# Altium project Analog_computer.PrjPcb
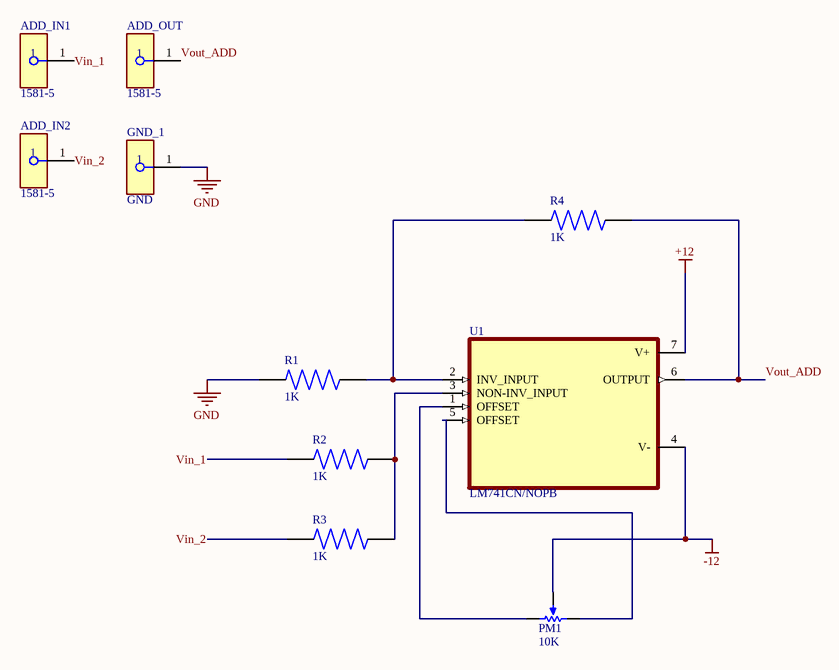
[diagram p0: Adder.SchDoc]
8 sheets, 121 parts. Net scope: global (net labels, ports and power ports of the same name join across sheets).
Board file: PCB1.PcbDoc
Sheets:
  Adder.SchDoc
  Substractor.SchDoc
  Power_IN.SchDoc
  Gain.SchDoc
  multiplier.SchDoc
  Differentiator.SchDoc
  Integrater.SchDoc
  Multiply_2.SchDoc

## Sheet Adder.SchDoc
size A; SheetNumber: 1; SheetTotal: 7

### Parts
ADD_IN1  1581-5  [FP-1581-5-MFG]
ADD_IN2  1581-5  [FP-1581-5-MFG]
ADD_OUT  1581-5  [FP-1581-5-MFG]
GND_1  GND  [FP-1581-5-MFG]
PM1  10K  [PCBComponent_1]
R1  1K  [RESAD1100W55L680D260]
R2  1K  [RESAD1100W55L680D260]
R3  1K  [RESAD1100W55L680D260]
R4  1K  [RESAD1100W55L680D260]
U1  LM741CN/NOPB  [DIP794W45P254L959H508Q8]

### Nets
+12: U1.7(V+)
-12: PM1.2(S) U1.4(V-)
GND: GND_1.1 R1.1
Vin_1: ADD_IN1.1 R2.1
Vin_2: ADD_IN2.1 R3.1
Vout_ADD: ADD_OUT.1 R4.2 U1.6(OUTPUT)
NetPM1_1: PM1.1(CCW) U1.5(OFFSET)
NetPM1_3: PM1.3(CW) U1.1(OFFSET)
NetR1_2: R1.2 R4.1 U1.2(INV_INPUT)
NetR2_2: R2.2 R3.2 U1.3(NON-INV_INPUT)

### Library data of the parts
ADD_IN1 ADD_IN2 ADD_OUT GND_1 = CMP-73906-000011-1: CONN BANANA JACK TURRET GREEN; Body Material: PC; Number of Contacts: 1; Max Current Rating: 15A; Voltage Rating (AC): 30V; Insulation: Mating End Insulated; Voltage Rating: 2.5kV; Voltage Rating (DC): 60V; Gender: Female; Height: 0.25inch; Mount: Panel; RoHS Compliant: Yes; Length: 1.22inch; Orientation: Straight; Diameter: 4.22mm; Lead Free: Lead Free; Package Quantity: 1; Termination: Turret; Current Rating: 15A; Packaging: Bag; Series: 1581; REACH SVHC: No SVHC; Number of Positions: 1; Contact Plating: Tin; Housing Color: Green; Contact Material: Brass; Insulation Material: Polycarbonate; Weight: 0.126lb; Number of Ports: 1; Color: Green; Housing Material: Polycarbonate; Width: 4inch
PM1 = Component_1
R1-R4 = MFR-25FBF52-1K: 1.07 kOhms Â±1% 0.25W, 1/4W Through Hole Resistor Axial - Metal Film; MF: Yageo; SnapEDA_Link: https://www.snapeda.com/parts/MFR-25FBF52-1K/Yageo/view-part/?ref=snap; Package: RADIAL-2 YAGEO; Value: *; MP: MFR-25FBF52-1K; Check_prices: https://www.snapeda.com/parts/MFR-25FBF52-1K/Yageo/view-part/?ref=eda
U1 = LM741CN/NOPB: Single, 44-V, 1-MHz operational amplifier; MF: Texas Instruments; SnapEDA_Link: https://www.snapeda.com/parts/LM741CN/NOPB/Texas+Instruments/view-part/?ref=snap; Package: PDIP-8 Texas; Value: *; MP: LM741CN/NOPB; Check_prices: https://www.snapeda.com/parts/LM741CN/NOPB/Texas+Instruments/view-part/?ref=eda

## Sheet Substractor.SchDoc
size A; SheetNumber: 2; SheetTotal: 7
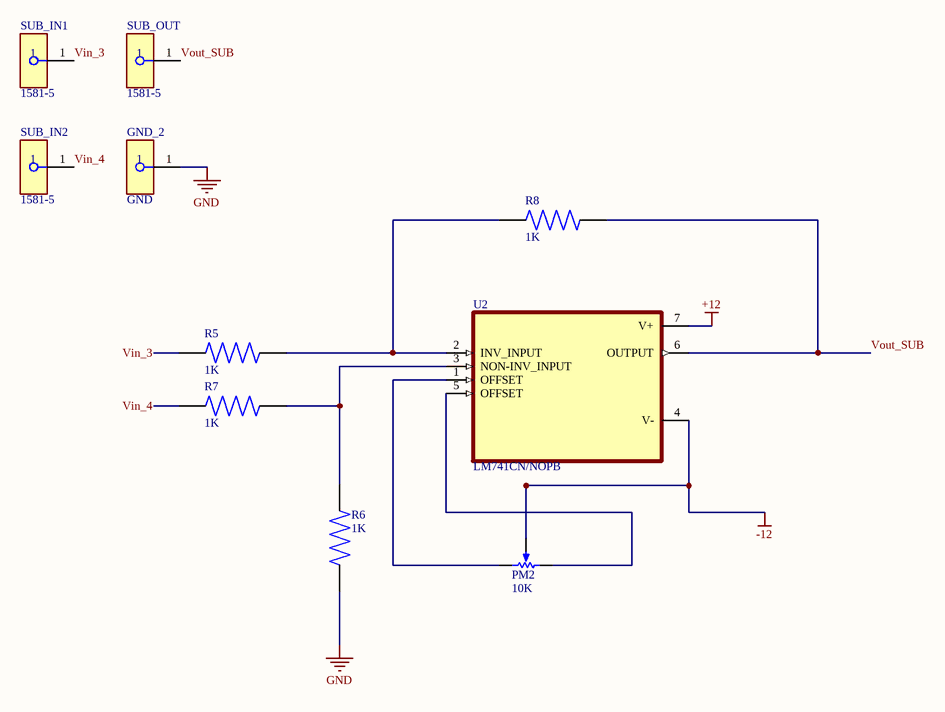
[diagram p1: Substractor.SchDoc]

### Parts
GND_2  GND  [FP-1581-5-MFG]
PM2  10K  [PCBComponent_1]
R5  1K  [RESAD1100W55L680D260]
R6  1K  [RESAD1100W55L680D260]
R7  1K  [RESAD1100W55L680D260]
R8  1K  [RESAD1100W55L680D260]
SUB_IN1  1581-5  [FP-1581-5-MFG]
SUB_IN2  1581-5  [FP-1581-5-MFG]
SUB_OUT  1581-5  [FP-1581-5-MFG]
U2  LM741CN/NOPB  [DIP794W45P254L959H508Q8]

### Nets
+12: U2.7(V+)
-12: PM2.2(S) U2.4(V-)
GND: GND_2.1 R6.1
Vin_3: R5.1 SUB_IN1.1
Vin_4: R7.1 SUB_IN2.1
Vout_SUB: R8.2 SUB_OUT.1 U2.6(OUTPUT)
NetPM2_1: PM2.1(CCW) U2.5(OFFSET)
NetPM2_3: PM2.3(CW) U2.1(OFFSET)
NetR5_2: R5.2 R8.1 U2.2(INV_INPUT)
NetR6_2: R6.2 R7.2 U2.3(NON-INV_INPUT)

### Library data of the parts
GND_2 SUB_IN1 SUB_IN2 SUB_OUT = CMP-73906-000011-1: as ADD_IN1 on sheet Adder; Height: 0.25inch; Mount: Panel; RoHS Compliant: Yes; Length: 1.22inch; Orientation: Straight; Diameter: 4.22mm; Lead Free: Lead Free; Package Quantity: 1; Termination: Turret; Current Rating: 15A; Packaging: Bag; Series: 1581; REACH SVHC: No SVHC; Number of Positions: 1; Contact Plating: Tin; Housing Color: Green; Contact Material: Brass; Insulation Material: Polycarbonate; Weight: 0.126lb; Number of Ports: 1; Color: Green; Housing Material: Polycarbonate; Width: 4inch
PM2 = Component_1
R5-R8 = MFR-25FBF52-1K: as R1 on sheet Adder; SnapEDA_Link: https://www.snapeda.com/parts/MFR-25FBF52-1K/Yageo/view-part/?ref=snap; Package: RADIAL-2 YAGEO; Value: *; MP: MFR-25FBF52-1K; Check_prices: https://www.snapeda.com/parts/MFR-25FBF52-1K/Yageo/view-part/?ref=eda
U2 = LM741CN/NOPB: as U1 on sheet Adder; SnapEDA_Link: https://www.snapeda.com/parts/LM741CN/NOPB/Texas+Instruments/view-part/?ref=snap; Package: PDIP-8 Texas; Value: *; MP: LM741CN/NOPB; Check_prices: https://www.snapeda.com/parts/LM741CN/NOPB/Texas+Instruments/view-part/?ref=eda

## Sheet Power_IN.SchDoc: Power in
size A; DocumentNumber: 01; SheetNumber: 3; SheetTotal: 7
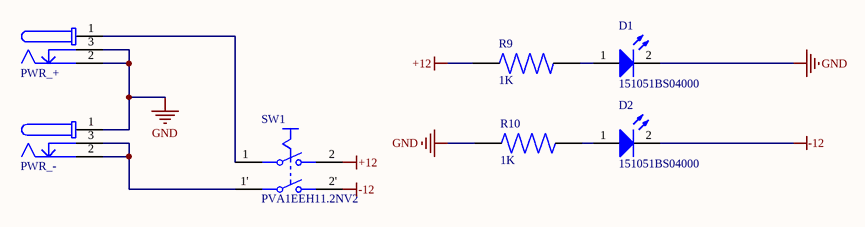
[diagram p2: Power_IN.SchDoc]

### Parts
D1  151051BS04000  [WL-TMRC_D5.9H8.7]
D2  151051BS04000  [WL-TMRC_D5.9H8.7]
PWR_+  694106301002  [PCBComponent_1]  (value not drawn)
PWR_-  694106301002  [PCBComponent_1]  (value not drawn)
R9  1K  [RESAD1100W55L680D260]
R10  1K  [RESAD1100W55L680D260]
SW1  PVA1EEH11.2NV2  [FP-PVA1EEH11_2NV2-MFG]

### Nets
+12: R9.1 SW1.2
-12: D2.2(K) SW1.2'
GND: D1.2(K) PWR_+.2 PWR_+.3 PWR_-.1 R10.1
NetD1_1: D1.1(A) R9.2
NetD2_1: D2.1(A) R10.2
NetPWR_+_1: PWR_+.1 SW1.1
NetPWR_-_2: PWR_-.2 PWR_-.3 SW1.1'

### Library data of the parts
D1 D2 = CMP-1488-00009-2: NexarPartId: 29717812; Test Current: 20mA; Forward Voltage: 3.2V; Wavelength: 470nm; Lens Size: 5mm; Lens Style: Circular, Diffused, Round; Forward Current: 100mA; Peak Wavelength: 465nm; Viewing Angle: 40°; Luminous Intensity: 500mcd; Max Reverse Voltage (DC): 5V; Color: Blue; Case/Package: Radial; Width: 5mm; Mount: Through Hole; Min Operating Temperature: -40°C; Length: 5mm; Height: 8.6mm; Max Operating Temperature: 85°C; Packaging: Bulk; RoHS: Compliant; REACH SVHC: Unknown; Dominant Wavelength: 470nm
PWR_+ PWR_- = 694106301002: DC Power Jack Connector WR-DC, Male, Right Angled, THT, 5 A, 24 V; Manufacturer: Wurth Elektronik; Current Rating: 5A; Insulation Resistance: 100MΩ; Number of Contacts: 3; Operating Supply Voltage: 24V; Shielding: Unshielded; Supplier: DigiKey; Supplier Part Number: 732-5930-ND; Manufacturer Part Number: 694106301002; RoHS: Compliant; Category: Power Connectors; Stock: 67461; Pricing: 1=0.92, 10=0.873, 50=0.774, 100=0.72, 500=0.621, 1000=0.531 (USD); Color: Black; Connector Type: Power; Contact Gender: Female; Contact Material: Gold, Tin; Contact Plating: Tin; Flammability Rating: UL94 V-0; Gender: Male; Height: 11mm; Housing Material: Polyamide; Max Operating Temperature: 85°C; Min Operating Temperature: -40°C; Mounting Technology: Through Hole; Packaging: Bulk; REACH SVHC: Unknown; Termination: Through Hole; Voltage Rating: 24V; ComponentLink1URL: https://datasheet.octopart.com:443/694106301002-W%C3%BCrth-Elektronik-datasheet-111088219.pdf?src-supplier=Newark; ComponentLink1Description: https://datasheet.octopart.com:443/694106301002-W%C3%BCrth-Elektronik-datasheet-111088219.pdf?src-supplier=Newark; ComponentLink2URL: https://datasheet.octopart.com:443/694106301002-W%C3%BCrth-Elektronik-datasheet-38737356.pdf?src-supplier=Farnell; ComponentLink2Description: https://datasheet.octopart.com:443/694106301002-W%C3%BCrth-Elektronik-datasheet-38737356.pdf?src-supplier=Farnell; ComponentLink3URL: https://datasheet.octopart.com:443/694106301002-W%C3%BCrth-Elektronik-datasheet-66582004.pdf?src-supplier=Farnell; ComponentLink3Description: https://datasheet.octopart.com:443/694106301002-W%C3%BCrth-Elektronik-datasheet-66582004.pdf?src-supplier=Farnell
R9 R10 = MFR-25FBF52-1K: as R1 on sheet Adder; SnapEDA_Link: https://www.snapeda.com/parts/MFR-25FBF52-1K/Yageo/view-part/?ref=snap; Package: RADIAL-2 YAGEO; Value: *; MP: MFR-25FBF52-1K; Check_prices: https://www.snapeda.com/parts/MFR-25FBF52-1K/Yageo/view-part/?ref=eda
SW1 = CMP-10035-000009-1: SWITCH PUSH DPST 0.1A 32V; Switch Function: Off-On; Current Rating: 100mA; Electrical Life: 100000Cycles; RoHS Compliant: Yes; Throw Configuration: DPST; Max Operating Temperature: 85°C; Voltage Rating (DC): 32V; Mount: Through Hole; Series: PVA; Min Operating Temperature: -40°C; Termination: PC Pin; Packaging: Bulk

## Sheet Gain.SchDoc
size A; SheetNumber: 4; SheetTotal: 7
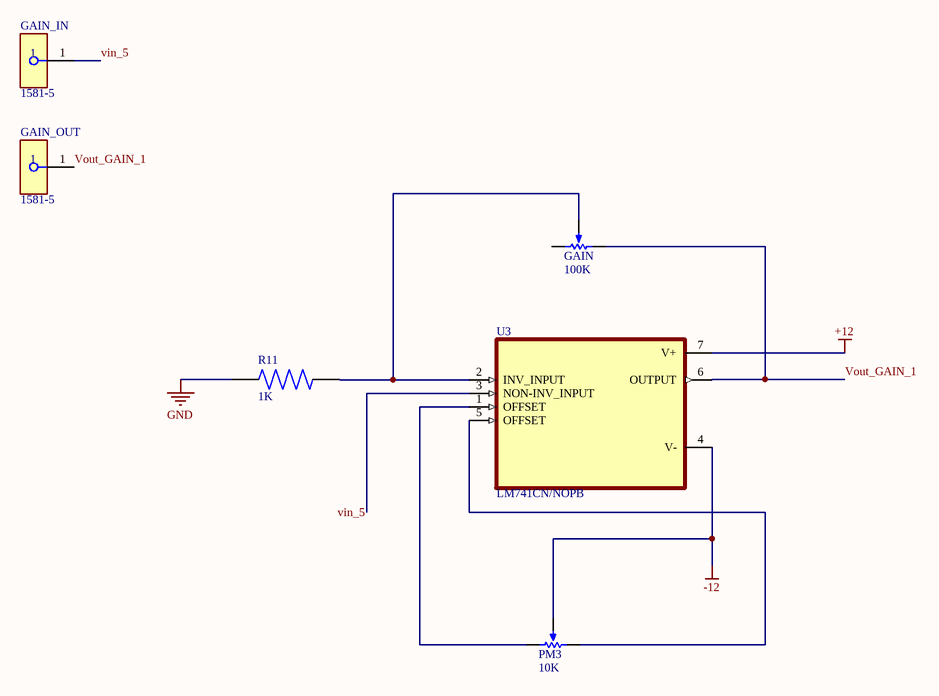
[diagram p3: Gain.SchDoc]

### Parts
GAIN  100K  [PCBComponent_1]
GAIN_IN  1581-5  [FP-1581-5-MFG]
GAIN_OUT  1581-5  [FP-1581-5-MFG]
PM3  10K  [PCBComponent_1]
R11  1K  [RESAD1100W55L680D260]
U3  LM741CN/NOPB  [DIP794W45P254L959H508Q8]

### Nets
+12: U3.7(V+)
-12: PM3.2(S) U3.4(V-)
GND: R11.1
vin_5: GAIN_IN.1 U3.3(NON-INV_INPUT)
Vout_GAIN_1: GAIN.1(CCW) GAIN_OUT.1 U3.6(OUTPUT)
NetGAIN_2: GAIN.2(S) R11.2 U3.2(INV_INPUT)
NetPM3_1: PM3.1(CCW) U3.5(OFFSET)
NetPM3_3: PM3.3(CW) U3.1(OFFSET)

Not connected (* = marked no-connect by the designer): GAIN 3(CW)

### Library data of the parts
GAIN PM3 = Component_1
GAIN_IN GAIN_OUT = CMP-73906-000011-1: as ADD_IN1 on sheet Adder; Height: 0.25inch; Mount: Panel; RoHS Compliant: Yes; Length: 1.22inch; Orientation: Straight; Diameter: 4.22mm; Lead Free: Lead Free; Package Quantity: 1; Termination: Turret; Current Rating: 15A; Packaging: Bag; Series: 1581; REACH SVHC: No SVHC; Number of Positions: 1; Contact Plating: Tin; Housing Color: Green; Contact Material: Brass; Insulation Material: Polycarbonate; Weight: 0.126lb; Number of Ports: 1; Color: Green; Housing Material: Polycarbonate; Width: 4inch
R11 = MFR-25FBF52-1K: as R1 on sheet Adder; SnapEDA_Link: https://www.snapeda.com/parts/MFR-25FBF52-1K/Yageo/view-part/?ref=snap; Package: RADIAL-2 YAGEO; Value: *; MP: MFR-25FBF52-1K; Check_prices: https://www.snapeda.com/parts/MFR-25FBF52-1K/Yageo/view-part/?ref=eda
U3 = LM741CN/NOPB: as U1 on sheet Adder; SnapEDA_Link: https://www.snapeda.com/parts/LM741CN/NOPB/Texas+Instruments/view-part/?ref=snap; Package: PDIP-8 Texas; Value: *; MP: LM741CN/NOPB; Check_prices: https://www.snapeda.com/parts/LM741CN/NOPB/Texas+Instruments/view-part/?ref=eda

## Sheet multiplier.SchDoc
size 431 x 279 mm; SheetNumber: 5; SheetTotal: 7
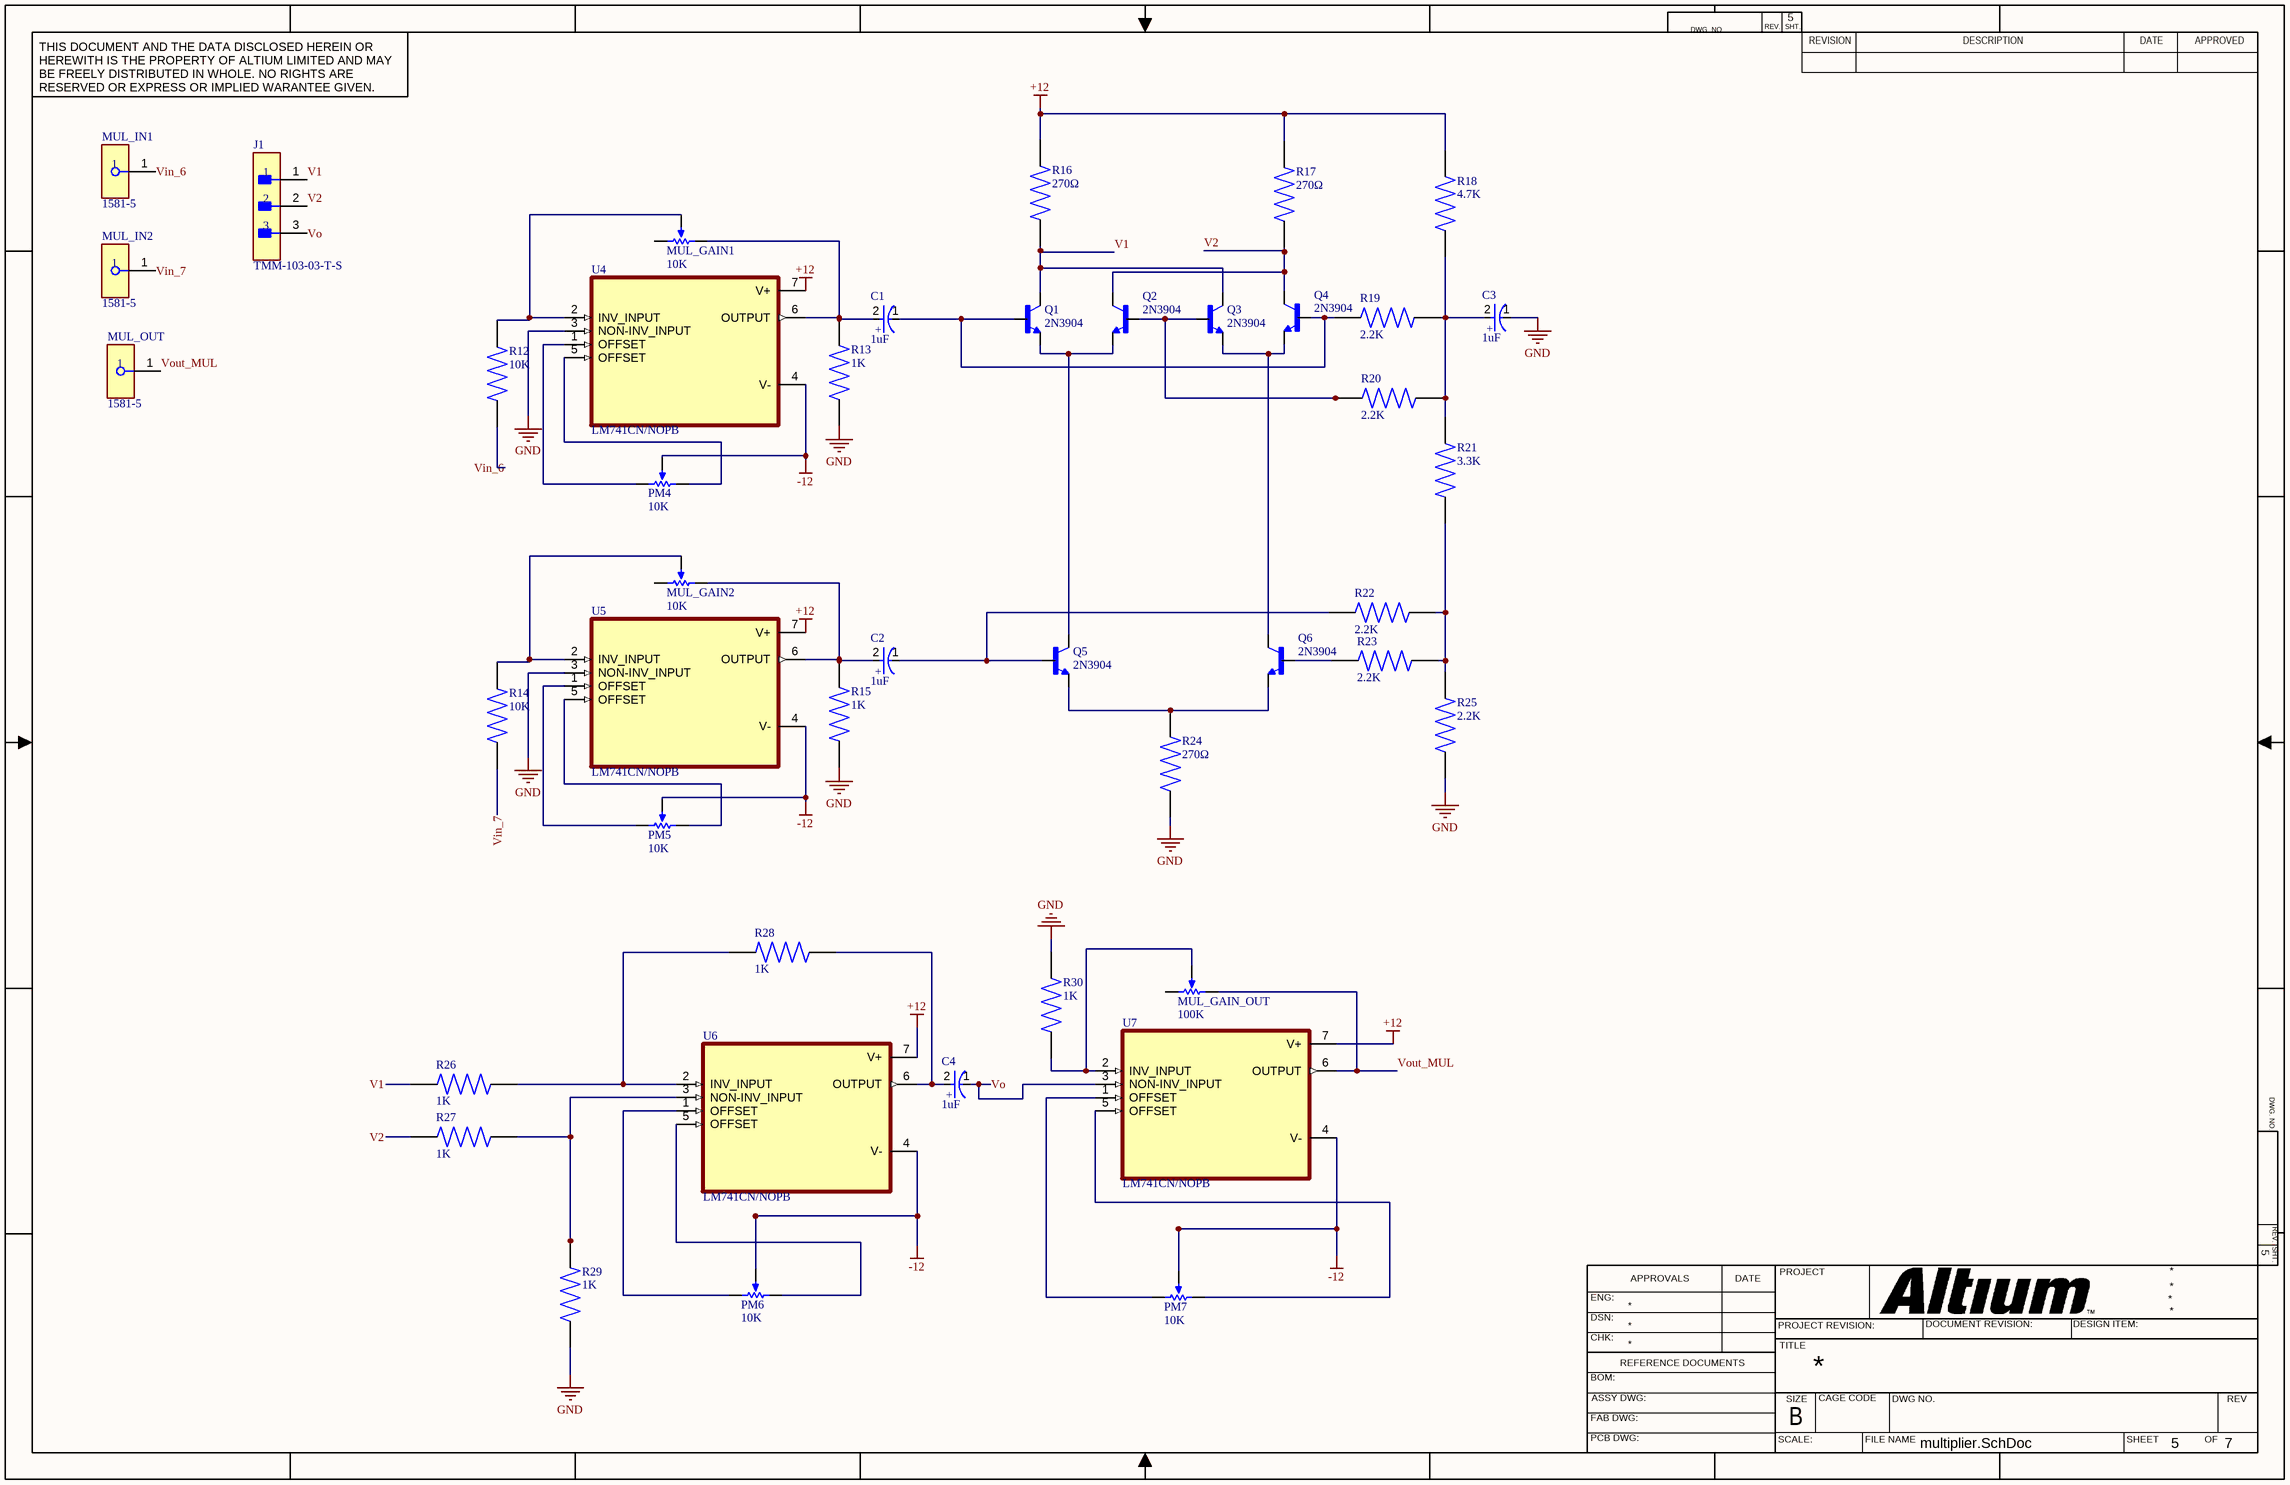
[diagram p4: multiplier.SchDoc]

### Parts
C1  1uF  [FP-ECA-2CHG010I-MFG]
C2  1uF  [FP-ECA-2CHG010I-MFG]
C3  1uF  [FP-ECA-2CHG010I-MFG]
C4  1uF  [FP-ECA-2CHG010I-MFG]
J1  TMM-103-03-T-S  [FP-TMM-103-03-T-S-MFG]
MUL_GAIN1  10K  [PCBComponent_1]
MUL_GAIN2  10K  [PCBComponent_1]
MUL_GAIN_OUT  100K  [PCBComponent_1]
MUL_IN1  1581-5  [FP-1581-5-MFG]
MUL_IN2  1581-5  [FP-1581-5-MFG]
MUL_OUT  1581-5  [FP-1581-5-MFG]
PM4  10K  [PCBComponent_1]
PM5  10K  [PCBComponent_1]
PM6  10K  [PCBComponent_1]
PM7  10K  [PCBComponent_1]
Q1  2N3904  [TO92254P460H750-3]
Q2  2N3904  [TO92254P460H750-3]
Q3  2N3904  [TO92254P460H750-3]
Q4  2N3904  [TO92254P460H750-3]
Q5  2N3904  [TO92254P460H750-3]
Q6  2N3904  [TO92254P460H750-3]
R12  10K  [RESAD1100W55L680D260]
R13  1K  [RESAD1100W55L680D260]
R14  10K  [RESAD1100W55L680D260]
R15  1K  [RESAD1100W55L680D260]
R16  270Ω  [RESAD1100W55L680D260]
R17  270Ω  [RESAD1100W55L680D260]
R18  4.7K  [RESAD1100W55L680D260]
R19  2.2K  [RESAD1100W55L680D260]
R20  2.2K  [RESAD1100W55L680D260]
R21  3.3K  [RESAD1100W55L680D260]
R22  2.2K  [RESAD1100W55L680D260]
R23  2.2K  [RESAD1100W55L680D260]
R24  270Ω  [RESAD1100W55L680D260]
R25  2.2K  [RESAD1100W55L680D260]
R26  1K  [RESAD1100W55L680D260]
R27  1K  [RESAD1100W55L680D260]
R28  1K  [RESAD1100W55L680D260]
R29  1K  [RESAD1100W55L680D260]
R30  1K  [RESAD1100W55L680D260]
U4  LM741CN/NOPB  [DIP794W45P254L959H508Q8]
U5  LM741CN/NOPB  [DIP794W45P254L959H508Q8]
U6  LM741CN/NOPB  [DIP794W45P254L959H508Q8]
U7  LM741CN/NOPB  [DIP794W45P254L959H508Q8]

### Nets
+12: R16.2 R17.2 R18.2 U4.7(V+) U5.7(V+) U6.7(V+) U7.7(V+)
-12: PM4.2(S) PM5.2(S) PM6.2(S) PM7.2(S) U4.4(V-) U5.4(V-) U6.4(V-) U7.4(V-)
GND: C3.1(C) R13.1 R15.1 R24.1 R25.1 R29.1 R30.1 U4.3(NON-INV_INPUT) U5.3(NON-INV_INPUT)
V1: J1.1 Q1.3(C) Q3.3(C) R16.1 R26.1
V2: J1.2 Q2.3(C) Q4.3(C) R17.1 R27.1
Vin_6: MUL_IN1.1 R12.1
Vin_7: MUL_IN2.1 R14.1
Vo: C4.1(C) J1.3 U7.3(NON-INV_INPUT)
Vout_MUL: MUL_GAIN_OUT.1(CCW) MUL_OUT.1 U7.6(OUTPUT)
NetC1_1: C1.1(C) Q1.2(B) Q4.2(B) R19.1
NetC1_2: C1.2(A) MUL_GAIN1.1(CCW) R13.2 U4.6(OUTPUT)
NetC2_1: C2.1(C) Q5.2(B) R22.1
NetC2_2: C2.2(A) MUL_GAIN2.1(CCW) R15.2 U5.6(OUTPUT)
NetC3_2: C3.2(A) R18.1 R19.2 R20.2 R21.2
NetC4_2: C4.2(A) R28.2 U6.6(OUTPUT)
NetMUL_GAIN1_2: MUL_GAIN1.2(S) R12.2 U4.2(INV_INPUT)
NetMUL_GAIN2_2: MUL_GAIN2.2(S) R14.2 U5.2(INV_INPUT)
NetMUL_GAIN_OUT_2: MUL_GAIN_OUT.2(S) R30.2 U7.2(INV_INPUT)
NetPM4_1: PM4.1(CCW) U4.5(OFFSET)
NetPM4_3: PM4.3(CW) U4.1(OFFSET)
NetPM5_1: PM5.1(CCW) U5.5(OFFSET)
NetPM5_3: PM5.3(CW) U5.1(OFFSET)
NetPM6_1: PM6.1(CCW) U6.5(OFFSET)
NetPM6_3: PM6.3(CW) U6.1(OFFSET)
NetPM7_1: PM7.1(CCW) U7.5(OFFSET)
NetPM7_3: PM7.3(CW) U7.1(OFFSET)
NetQ1_1: Q1.1(E) Q2.1(E) Q5.3(C)
NetQ2_2: Q2.2(B) Q3.2(B) R20.1
NetQ3_1: Q3.1(E) Q4.1(E) Q6.3(C)
NetQ5_1: Q5.1(E) Q6.1(E) R24.2
NetQ6_2: Q6.2(B) R23.1
NetR21_1: R21.1 R22.2 R23.2 R25.2
NetR26_2: R26.2 R28.1 U6.2(INV_INPUT)
NetR27_2: R27.2 R29.2 U6.3(NON-INV_INPUT)

Not connected (* = marked no-connect by the designer): MUL_GAIN1 3(CW); MUL_GAIN2 3(CW); MUL_GAIN_OUT 3(CW)

### Notes on the sheet
- DWG. NO.
- REV.
- SHT.
- THIS DOCUMENT AND THE DATA DISCLOSED HEREIN OR HEREWITH IS THE PROPERTY OF ALTIUM LIMITED AND MAY BE FREELY DISTRIBUTED IN WHOLE. NO RIGHTS ARE RESERVED OR EXPRESS OR IMPLIED WARANTEE GIVEN.
- REVISION
- DESCRIPTION
- DATE
- APPROVED
- ENG:
- APPROVALS
- PROJECT
- DSN:
- CHK:
- REFERENCE DOCUMENTS
- PROJECT REVISION:
- TITLE
- DOCUMENT REVISION:
- DESIGN ITEM:
- BOM:
- FAB DWG:
- PCB DWG:
- ASSY DWG:
- SCALE:
- SIZE
- B
- CAGE CODE
- FILE NAME
- DWG NO.
- SHEET
- OF
- REV
- (in symbol CMP-05427-002176-1) +

### Library data of the parts
C1-C4 = CMP-05427-002176-1: CAP ALUM 1UF 20% 160V RADIAL; Lead/Base Style: Straight; Ripple Current: 17mA; Life (Hours): 2000Hour; Voltage Rating (DC): 160V; Max Operating Temperature: 105°C; Radiation Hardening: No; Min Operating Temperature: -25°C; Packaging: Ammo Pack; Series: NHG; Capacitance: 1uF; Height - Seated (Max): 0.48inch; Lead Pitch: 2.5mm; Diameter: 6.3mm; Length: 11.2mm; Package Quantity: 2000; Termination: Radial; RoHS Compliant: Yes; Voltage Rating: 160V; Tolerance: 20%; Height: 11.2mm; Case/Package: Radial; Mount: Through Hole
J1 = CMP-02766-001695-1: CONN HEADER VERT 3POS 2MM; Gender: Male; Number of Positions: 3; Max Current Rating: 3.9A; Max Voltage Rating (AC): 500V; Packaging: Bulk; RoHS Compliant: Yes; Mount: Through Hole; Length: 6mm; Contact Type: Male Pin; Package Quantity: 1; Depth: 1.97mm; Contact Material: Bronze; Insulation Material: Polymer; Series: TMM; Contact Plating: Tin; Fastening Type: Pull; Housing Color: Black; Pitch: 2mm; Termination: Solder; Contact Mating Length: 0.157inch; Min Operating Temperature: -55°C; REACH SVHC: No SVHC; Orientation: Straight; Number of Rows: 1; Color: Black; Insulation Color: Black; Connector Type: Header; Radiation Hardening: No; Number of Contacts: 3; Lead Free: Lead Free; Contact Finish - Mating: TIN; Max Operating Temperature: 105°C; Housing Material: Polymer; Contact Shape: Square
MUL_GAIN1 MUL_GAIN2 MUL_GAIN_OUT PM4-PM7 = Component_1
MUL_IN1 MUL_IN2 MUL_OUT = CMP-73906-000011-1: as ADD_IN1 on sheet Adder; Height: 0.25inch; Mount: Panel; RoHS Compliant: Yes; Length: 1.22inch; Orientation: Straight; Diameter: 4.22mm; Lead Free: Lead Free; Package Quantity: 1; Termination: Turret; Current Rating: 15A; Packaging: Bag; Series: 1581; REACH SVHC: No SVHC; Number of Positions: 1; Contact Plating: Tin; Housing Color: Green; Contact Material: Brass; Insulation Material: Polycarbonate; Weight: 0.126lb; Number of Ports: 1; Color: Green; Housing Material: Polycarbonate; Width: 4inch
Q1-Q6 = 2N3904: BJT, TO-92, 40V, 200mA, NPN, 0.625W, 150Â°C; MF: Diotec Semiconductor; SnapEDA_Link: https://www.snapeda.com/parts/2N3904/Diotec/view-part/?ref=snap; Package: TO-92 Diotec; Value: *; MP: 2N3904; Check_prices: https://www.snapeda.com/parts/2N3904/Diotec/view-part/?ref=eda
R12-R30 = MFR-25FBF52-1K: as R1 on sheet Adder; SnapEDA_Link: https://www.snapeda.com/parts/MFR-25FBF52-1K/Yageo/view-part/?ref=snap; Package: RADIAL-2 YAGEO; Value: *; MP: MFR-25FBF52-1K; Check_prices: https://www.snapeda.com/parts/MFR-25FBF52-1K/Yageo/view-part/?ref=eda
U4-U7 = LM741CN/NOPB: as U1 on sheet Adder; SnapEDA_Link: https://www.snapeda.com/parts/LM741CN/NOPB/Texas+Instruments/view-part/?ref=snap; Package: PDIP-8 Texas; Value: *; MP: LM741CN/NOPB; Check_prices: https://www.snapeda.com/parts/LM741CN/NOPB/Texas+Instruments/view-part/?ref=eda

## Sheet Differentiator.SchDoc
size A; SheetNumber: 6; SheetTotal: 7
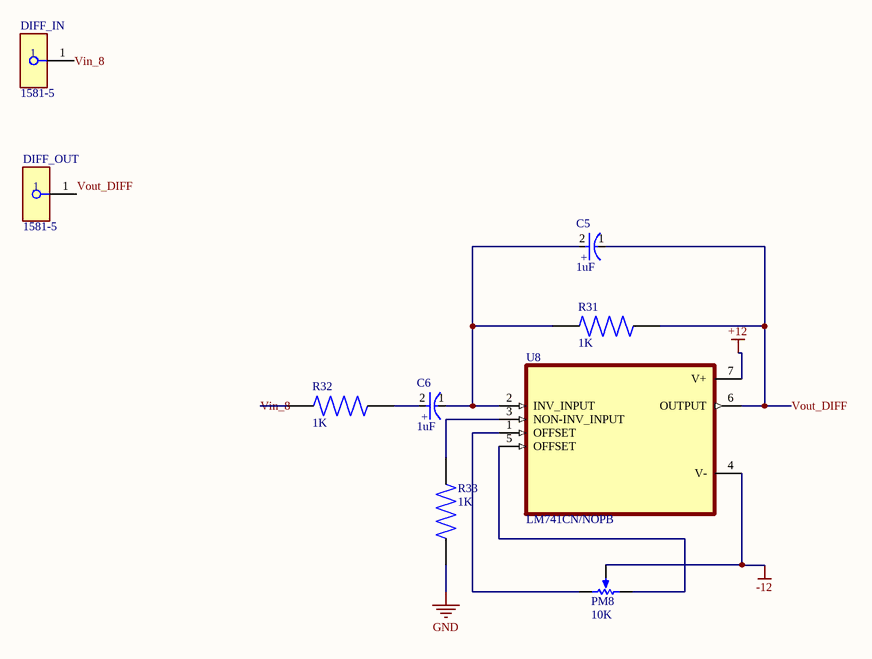
[diagram p5: Differentiator.SchDoc]

### Parts
C5  1uF  [FP-ECA-2CHG010I-MFG]
C6  1uF  [FP-ECA-2CHG010I-MFG]
DIFF_IN  1581-5  [FP-1581-5-MFG]
DIFF_OUT  1581-5  [FP-1581-5-MFG]
PM8  10K  [PCBComponent_1]
R31  1K  [RESAD1100W55L680D260]
R32  1K  [RESAD1100W55L680D260]
R33  1K  [RESAD1100W55L680D260]
U8  LM741CN/NOPB  [DIP794W45P254L959H508Q8]

### Nets
+12: U8.7(V+)
-12: PM8.2(S) U8.4(V-)
GND: R33.1
Vin_8: DIFF_IN.1 R32.1
Vout_DIFF: C5.1(C) DIFF_OUT.1 R31.2 U8.6(OUTPUT)
NetC5_2: C5.2(A) C6.1(C) R31.1 U8.2(INV_INPUT)
NetC6_2: C6.2(A) R32.2
NetPM8_1: PM8.1(CCW) U8.5(OFFSET)
NetPM8_3: PM8.3(CW) U8.1(OFFSET)
NetR33_2: R33.2 U8.3(NON-INV_INPUT)

### Notes on the sheet
- (in symbol CMP-05427-002176-1) +

### Library data of the parts
C5 C6 = CMP-05427-002176-1: as C1 on sheet multiplier; Voltage Rating (DC): 160V; Max Operating Temperature: 105°C; Radiation Hardening: No; Min Operating Temperature: -25°C; Packaging: Ammo Pack; Series: NHG; Capacitance: 1uF; Height - Seated (Max): 0.48inch; Lead Pitch: 2.5mm; Diameter: 6.3mm; Length: 11.2mm; Package Quantity: 2000; Termination: Radial; RoHS Compliant: Yes; Voltage Rating: 160V; Tolerance: 20%; Height: 11.2mm; Case/Package: Radial; Mount: Through Hole
DIFF_IN DIFF_OUT = CMP-73906-000011-1: as ADD_IN1 on sheet Adder; Height: 0.25inch; Mount: Panel; RoHS Compliant: Yes; Length: 1.22inch; Orientation: Straight; Diameter: 4.22mm; Lead Free: Lead Free; Package Quantity: 1; Termination: Turret; Current Rating: 15A; Packaging: Bag; Series: 1581; REACH SVHC: No SVHC; Number of Positions: 1; Contact Plating: Tin; Housing Color: Green; Contact Material: Brass; Insulation Material: Polycarbonate; Weight: 0.126lb; Number of Ports: 1; Color: Green; Housing Material: Polycarbonate; Width: 4inch
PM8 = Component_1
R31-R33 = MFR-25FBF52-1K: as R1 on sheet Adder; SnapEDA_Link: https://www.snapeda.com/parts/MFR-25FBF52-1K/Yageo/view-part/?ref=snap; Package: RADIAL-2 YAGEO; Value: *; MP: MFR-25FBF52-1K; Check_prices: https://www.snapeda.com/parts/MFR-25FBF52-1K/Yageo/view-part/?ref=eda
U8 = LM741CN/NOPB: as U1 on sheet Adder; SnapEDA_Link: https://www.snapeda.com/parts/LM741CN/NOPB/Texas+Instruments/view-part/?ref=snap; Package: PDIP-8 Texas; Value: *; MP: LM741CN/NOPB; Check_prices: https://www.snapeda.com/parts/LM741CN/NOPB/Texas+Instruments/view-part/?ref=eda

## Sheet Integrater.SchDoc
size A; SheetNumber: 7; SheetTotal: 7
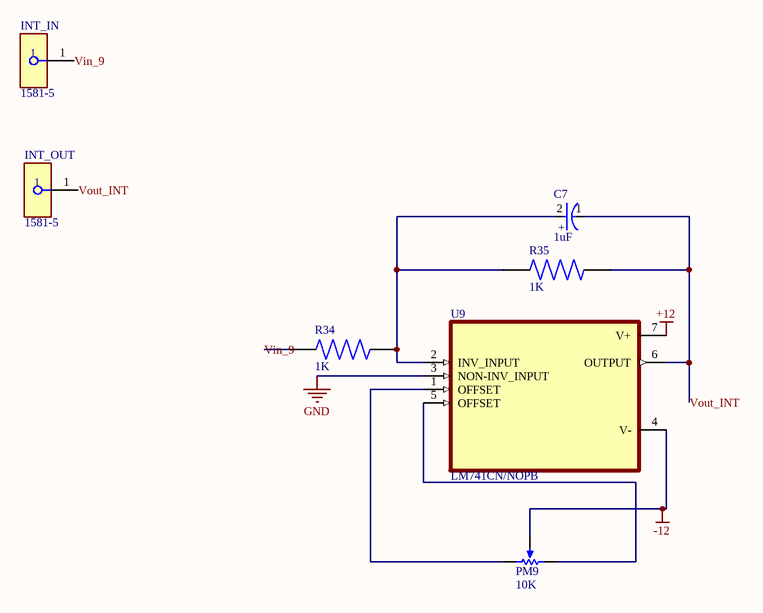
[diagram p6: Integrater.SchDoc]

### Parts
C7  1uF  [FP-ECA-2CHG010I-MFG]
INT_IN  1581-5  [FP-1581-5-MFG]
INT_OUT  1581-5  [FP-1581-5-MFG]
PM9  10K  [PCBComponent_1]
R34  1K  [RESAD1100W55L680D260]
R35  1K  [RESAD1100W55L680D260]
U9  LM741CN/NOPB  [DIP794W45P254L959H508Q8]

### Nets
+12: U9.7(V+)
-12: PM9.2(S) U9.4(V-)
GND: U9.3(NON-INV_INPUT)
Vin_9: INT_IN.1 R34.1
Vout_INT: C7.1(C) INT_OUT.1 R35.2 U9.6(OUTPUT)
NetC7_2: C7.2(A) R34.2 R35.1 U9.2(INV_INPUT)
NetPM9_1: PM9.1(CCW) U9.5(OFFSET)
NetPM9_3: PM9.3(CW) U9.1(OFFSET)

### Notes on the sheet
- (in symbol CMP-05427-002176-1) +

### Library data of the parts
C7 = CMP-05427-002176-1: as C1 on sheet multiplier; Voltage Rating (DC): 160V; Max Operating Temperature: 105°C; Radiation Hardening: No; Min Operating Temperature: -25°C; Packaging: Ammo Pack; Series: NHG; Capacitance: 1uF; Height - Seated (Max): 0.48inch; Lead Pitch: 2.5mm; Diameter: 6.3mm; Length: 11.2mm; Package Quantity: 2000; Termination: Radial; RoHS Compliant: Yes; Voltage Rating: 160V; Tolerance: 20%; Height: 11.2mm; Case/Package: Radial; Mount: Through Hole
INT_IN INT_OUT = CMP-73906-000011-1: as ADD_IN1 on sheet Adder; Height: 0.25inch; Mount: Panel; RoHS Compliant: Yes; Length: 1.22inch; Orientation: Straight; Diameter: 4.22mm; Lead Free: Lead Free; Package Quantity: 1; Termination: Turret; Current Rating: 15A; Packaging: Bag; Series: 1581; REACH SVHC: No SVHC; Number of Positions: 1; Contact Plating: Tin; Housing Color: Green; Contact Material: Brass; Insulation Material: Polycarbonate; Weight: 0.126lb; Number of Ports: 1; Color: Green; Housing Material: Polycarbonate; Width: 4inch
PM9 = Component_1
R34 R35 = MFR-25FBF52-1K: as R1 on sheet Adder; SnapEDA_Link: https://www.snapeda.com/parts/MFR-25FBF52-1K/Yageo/view-part/?ref=snap; Package: RADIAL-2 YAGEO; Value: *; MP: MFR-25FBF52-1K; Check_prices: https://www.snapeda.com/parts/MFR-25FBF52-1K/Yageo/view-part/?ref=eda
U9 = LM741CN/NOPB: as U1 on sheet Adder; SnapEDA_Link: https://www.snapeda.com/parts/LM741CN/NOPB/Texas+Instruments/view-part/?ref=snap; Package: PDIP-8 Texas; Value: *; MP: LM741CN/NOPB; Check_prices: https://www.snapeda.com/parts/LM741CN/NOPB/Texas+Instruments/view-part/?ref=eda

## Sheet Multiply_2.SchDoc
size A; SheetNumber: 8; SheetTotal: 8
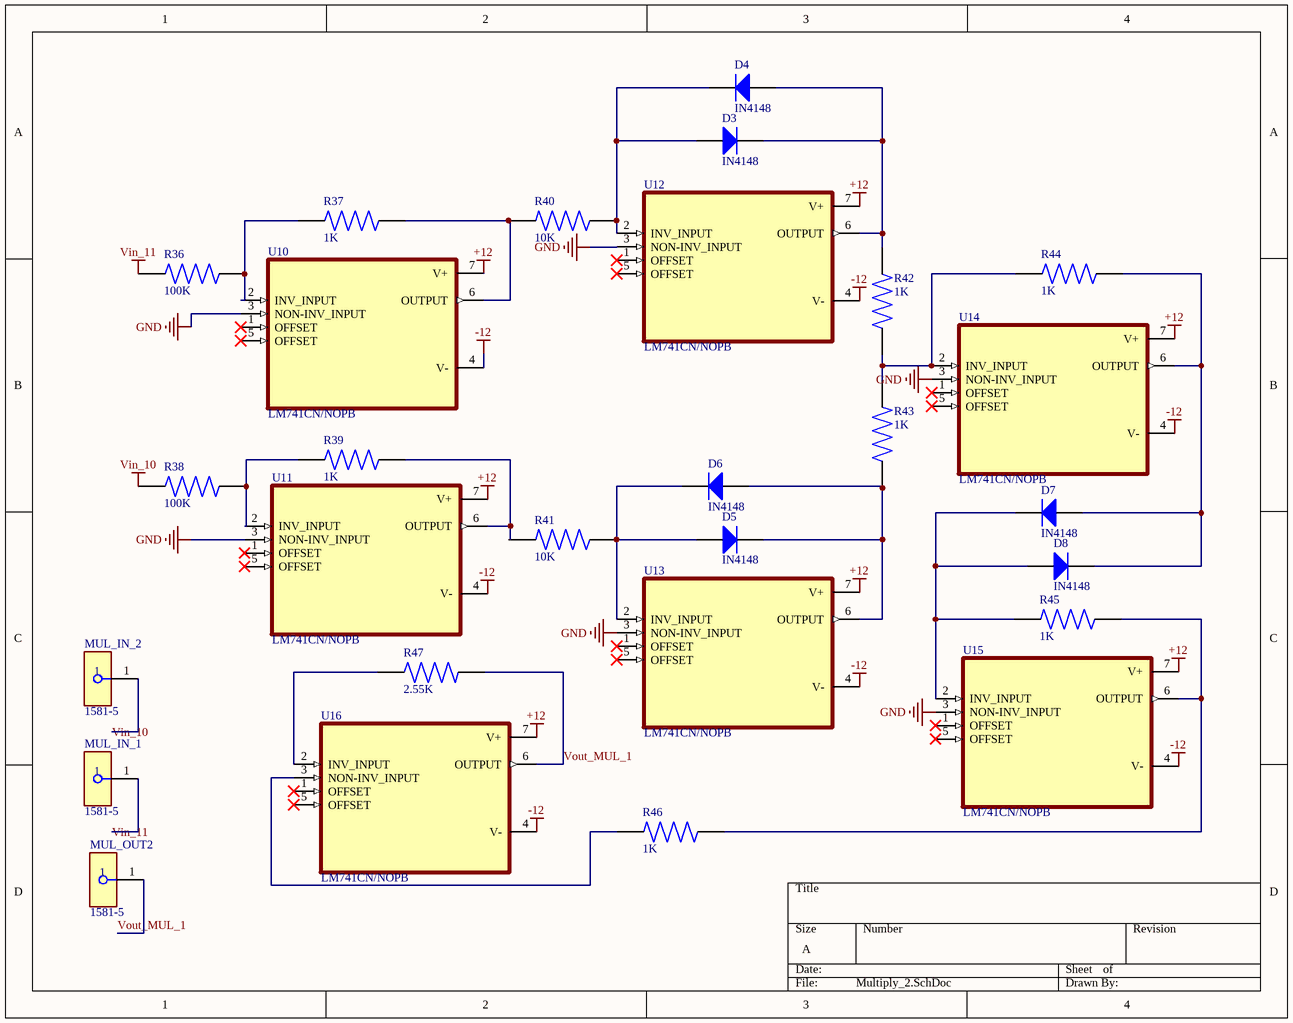
[diagram p7: Multiply_2.SchDoc]

### Parts
D3  IN4148  [PCBComponent_1]
D4  IN4148  [PCBComponent_1]
D5  IN4148  [PCBComponent_1]
D6  IN4148  [PCBComponent_1]
D7  IN4148  [PCBComponent_1]
D8  IN4148  [PCBComponent_1]
MUL_IN_1  1581-5  [FP-1581-5-MFG]
MUL_IN_2  1581-5  [FP-1581-5-MFG]
MUL_OUT2  1581-5  [FP-1581-5-MFG]
R36  100K  [RESAD1100W55L680D260]
R37  1K  [RESAD1100W55L680D260]
R38  100K  [RESAD1100W55L680D260]
R39  1K  [RESAD1100W55L680D260]
R40  10K  [RESAD1100W55L680D260]
R41  10K  [RESAD1100W55L680D260]
R42  1K  [RESAD1100W55L680D260]
R43  1K  [RESAD1100W55L680D260]
R44  1K  [RESAD1100W55L680D260]
R45  1K  [RESAD1100W55L680D260]
R46  1K  [RESAD1100W55L680D260]
R47  2.55K  [RESAD1100W55L680D260]
U10  LM741CN/NOPB  [DIP794W45P254L959H508Q8]
U11  LM741CN/NOPB  [DIP794W45P254L959H508Q8]
U12  LM741CN/NOPB  [DIP794W45P254L959H508Q8]
U13  LM741CN/NOPB  [DIP794W45P254L959H508Q8]
U14  LM741CN/NOPB  [DIP794W45P254L959H508Q8]
U15  LM741CN/NOPB  [DIP794W45P254L959H508Q8]
U16  LM741CN/NOPB  [DIP794W45P254L959H508Q8]

### Nets
+12: U10.7(V+) U11.7(V+) U12.7(V+) U13.7(V+) U14.7(V+) U15.7(V+) U16.7(V+)
-12: U10.4(V-) U11.4(V-) U12.4(V-) U13.4(V-) U14.4(V-) U15.4(V-) U16.4(V-)
GND: U10.3(NON-INV_INPUT) U11.3(NON-INV_INPUT) U12.3(NON-INV_INPUT) U13.3(NON-INV_INPUT) U14.3(NON-INV_INPUT) U15.3(NON-INV_INPUT)
Vin_10: MUL_IN_2.1 R38.1
Vin_11: MUL_IN_1.1 R36.1
Vout_MUL_1: MUL_OUT2.1 R47.2 U16.6(OUTPUT)
NetD3_1: D3.1(K) D4.2(A) R42.1 U12.6(OUTPUT)
NetD3_2: D3.2(A) D4.1(K) R40.2 U12.2(INV_INPUT)
NetD5_1: D5.1(K) D6.2(A) R43.1 U13.6(OUTPUT)
NetD5_2: D5.2(A) D6.1(K) R41.2 U13.2(INV_INPUT)
NetD7_1: D7.1(K) D8.2(A) R45.1 U15.2(INV_INPUT)
NetD7_2: D7.2(A) D8.1(K) R44.2 U14.6(OUTPUT)
NetR36_2: R36.2 R37.1 U10.2(INV_INPUT)
NetR37_2: R37.2 R40.1 U10.6(OUTPUT)
NetR38_2: R38.2 R39.1 U11.2(INV_INPUT)
NetR39_2: R39.2 U11.6(OUTPUT)
NetR42_2: R42.2 R43.2 R44.1 U14.2(INV_INPUT)
NetR45_2: R45.2 R46.2 U15.6(OUTPUT)
NetR46_1: R46.1 U16.3(NON-INV_INPUT)
NetR47_1: R47.1 U16.2(INV_INPUT)

Not connected (* = marked no-connect by the designer): R41 1; U10 1(OFFSET)* 5(OFFSET)*; U11 1(OFFSET)* 5(OFFSET)*; U12 1(OFFSET)* 5(OFFSET)*; U13 1(OFFSET)* 5(OFFSET)*; U14 1(OFFSET)* 5(OFFSET)*; U15 1(OFFSET)* 5(OFFSET)*; U16 1(OFFSET)* 5(OFFSET)*

### Library data of the parts
D3-D8 = Component_1
MUL_IN_1 MUL_IN_2 MUL_OUT2 = CMP-73906-000011-1: as ADD_IN1 on sheet Adder; Height: 0.25inch; Mount: Panel; RoHS Compliant: Yes; Length: 1.22inch; Orientation: Straight; Diameter: 4.22mm; Lead Free: Lead Free; Package Quantity: 1; Termination: Turret; Current Rating: 15A; Packaging: Bag; Series: 1581; REACH SVHC: No SVHC; Number of Positions: 1; Contact Plating: Tin; Housing Color: Green; Contact Material: Brass; Insulation Material: Polycarbonate; Weight: 0.126lb; Number of Ports: 1; Color: Green; Housing Material: Polycarbonate; Width: 4inch
R36-R47 = MFR-25FBF52-1K: as R1 on sheet Adder; SnapEDA_Link: https://www.snapeda.com/parts/MFR-25FBF52-1K/Yageo/view-part/?ref=snap; Package: RADIAL-2 YAGEO; Value: *; MP: MFR-25FBF52-1K; Check_prices: https://www.snapeda.com/parts/MFR-25FBF52-1K/Yageo/view-part/?ref=eda
U10-U16 = LM741CN/NOPB: as U1 on sheet Adder; SnapEDA_Link: https://www.snapeda.com/parts/LM741CN/NOPB/Texas+Instruments/view-part/?ref=snap; Package: PDIP-8 Texas; Value: *; MP: LM741CN/NOPB; Check_prices: https://www.snapeda.com/parts/LM741CN/NOPB/Texas+Instruments/view-part/?ref=eda

## Nets that join several sheets
+12: Adder (U1.7), Substractor (U2.7), Power_IN (R9.1 SW1.2), Gain (U3.7), multiplier (7 pins), Differentiator (U8.7), Integrater (U9.7), Multiply_2 (7 pins)
-12: Adder (PM1.2 U1.4), Substractor (PM2.2 U2.4), Power_IN (D2.2 SW1.2'), Gain (PM3.2 U3.4), multiplier (8 pins), Differentiator (PM8.2 U8.4), Integrater (PM9.2 U9.4), Multiply_2 (7 pins)
GND: Adder (GND_1.1 R1.1), Substractor (GND_2.1 R6.1), Power_IN (5 pins), Gain (R11.1), multiplier (9 pins), Differentiator (R33.1), Integrater (U9.3), Multiply_2 (6 pins)